# Altium schematic sheet FPGA_Banks_4_5_6.SchDoc
size A4
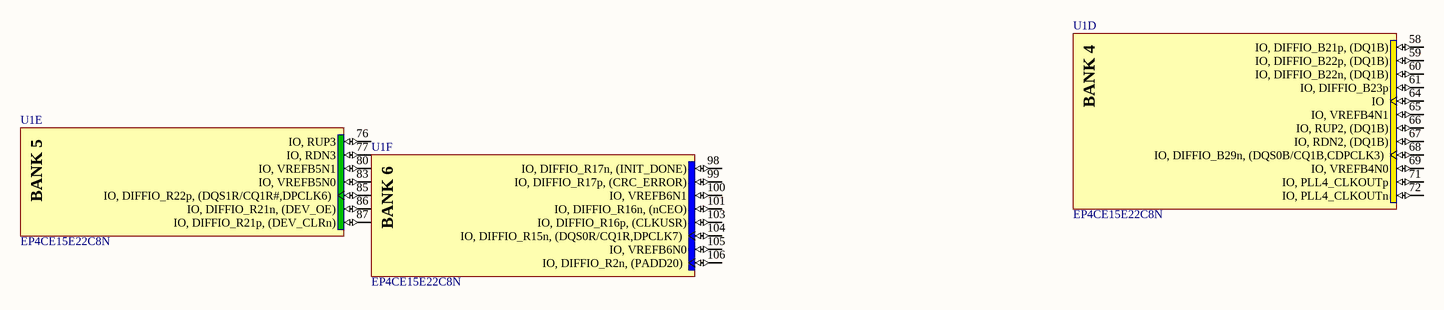
[diagram p0: FPGA_Banks_4_5_6.SchDoc]

## Parts
U1  EP4CE15E22C8N  [EQFP144_A-165_D2-67_L]  (parts D,E,F of 13)

## Nets

Not connected (* = marked no-connect by the designer): U1 58(IO,_DIFFIO_B21p,_(DQ1B)) 59(IO,_DIFFIO_B22p,_(DQ1B)) 60(IO,_DIFFIO_B22n,_(DQ1B)) 61(IO,_DIFFIO_B23p) 64(IO) 65(IO,_VREFB4N1) 66(IO,_RUP2,_(DQ1B)) 67(IO,_RDN2,_(DQ1B)) 68(IO,_DIFFIO_B29n,_(DQS0B/CQ1B,CDPCLK3)) 69(IO,_VREFB4N0) 71(IO,_PLL4_CLKOUTp) 72(IO,_PLL4_CLKOUTn) 76(IO,_RUP3) 77(IO,_RDN3) 80(IO,_VREFB5N1) 83(IO,_VREFB5N0) 85(IO,_DIFFIO_R22p,_(DQS1R/CQ1R#,DPCLK6)) 86(IO,_DIFFIO_R21n,_(DEV_OE)) 87(IO,_DIFFIO_R21p,_(DEV_CLRn)) 98(IO,_DIFFIO_R17n,_(INIT_DONE)) 99(IO,_DIFFIO_R17p,_(CRC_ERROR)) 100(IO,_VREFB6N1) 101(IO,_DIFFIO_R16n,_(nCEO)) 103(IO,_DIFFIO_R16p,_(CLKUSR)) 104(IO,_DIFFIO_R15n,_(DQS0R/CQ1R,DPCLK7)) 105(IO,_VREFB6N0) 106(IO,_DIFFIO_R2n,_(PADD20))

## Notes on the sheet
- (in symbol EP4CE15E22C8N, part D) BANK 4
- (in symbol EP4CE15E22C8N, part E) BANK 5
- (in symbol EP4CE15E22C8N, part F) BANK 6

## Library data of the parts
U1 = EP4CE15E22C8N: Cyclone IV Family FPGA, 1.2V Core, 81 I/O Pins, 4 PLLs, 144-Pin QFP, Speed Grade 8, Commercial Grade, Pb-Free; Manufacturer: Altera; DatasheetVersion: ver1.6, Nov-2011; PackageVersion: ver1.0, Jun-2011; PackageReference: EQFP144_A-165_D2-67; PackageDescription: 144-Pin Plastic Enhanced Quad Flat Pack (EQFP) - Wire Bond - A:1.65 - D2:6.7; Code_JEDEC: MS-026-BFB-HD; ComponentLink1Description: Manufacturer URL; ComponentLink1URL: http://www.altera.com/; ComponentLink2Description: Handbook; ComponentLink2URL: http://www.altera.com/literature/hb/cyclone-iv/cyclone4-handbook.pdf; ComponentLink3Description: Pinout; ComponentLink3URL: http://www.altera.com/literature/lit-dp.jsp?category=cyc%204&showspreadsheet=y; ComponentLink4Description: Package Specification; ComponentLink4URL: http://www.altera.com/devicepackaging/04R00221-02.pdf